# EAGLE schematic TDBR_MCP9802 (EAGLE 7.2.0)
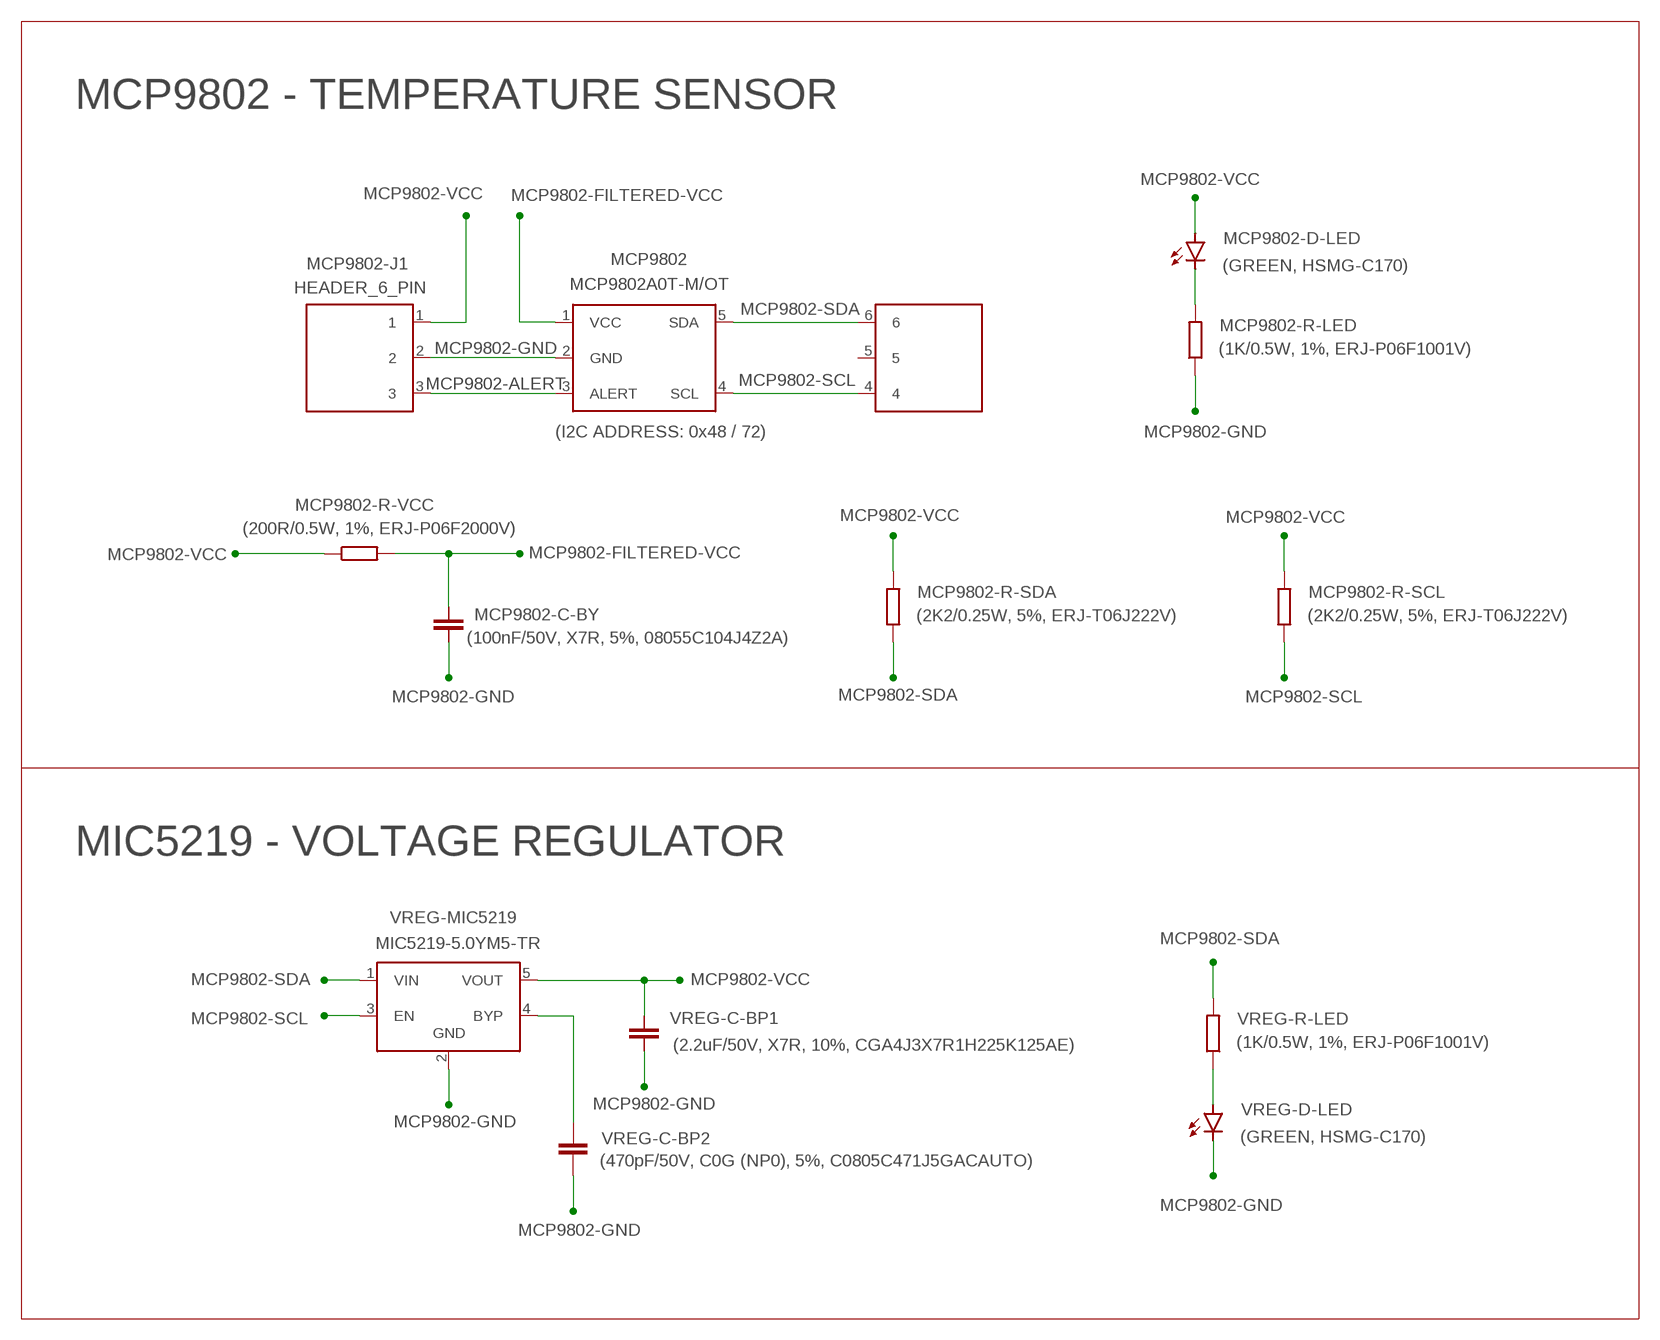
[diagram p0: schematic, sheet 1]

## Parts
MCP9802  MCP9802A0T-M/OT  [SOT-23-5]
MCP9802-C-BY  (100nF/50V, X7R, 5%, 08055C104J4Z2A)  08055C104J4Z2A  [0805]
MCP9802-D-LED  (GREEN, HSMG-C170)  HSMG-C170  [DIODE_0805]
MCP9802-J1  HEADER_6_PIN  [HEADER_2.54MM_6_PIN_VER]
MCP9802-R-LED  (1K/0.5W, 1%, ERJ-P06F1001V)  ERJ-P06F1001V  [0805]
MCP9802-R-SCL  (2K2/0.25W, 5%, ERJ-T06J222V)  ERJ-T06J222V  [0805]
MCP9802-R-SDA  (2K2/0.25W, 5%, ERJ-T06J222V)  ERJ-T06J222V  [0805]
MCP9802-R-VCC  (200R/0.5W, 1%, ERJ-P06F2000V)  ERJ-P06F2000V  [0805]
VREG-C-BP1  (2.2uF/50V, X7R, 10%, CGA4J3X7R1H225K125AE)  CGA4J3X7R1H225K125AE  [0805]
VREG-C-BP2  (470pF/50V, C0G (NP0), 5%, C0805C471J5GACAUTO)  C0805X471J5GACTU  [0805]
VREG-D-LED  (GREEN, HSMG-C170)  HSMG-C170  [DIODE_0805]
VREG-MIC5219  MIC5219-5.0YM5-TR  [SOT-23-5]
VREG-R-LED  (1K/0.5W, 1%, ERJ-P06F1001V)  ERJ-P06F1001V  [0805]

## Nets
MCP9802-ALERT: MCP9802-J1.3 MCP9802.3(ALERT)
MCP9802-FILTERED-VCC: MCP9802-C-BY.1(A) MCP9802-R-VCC.2 MCP9802.1(VCC)
MCP9802-GND: MCP9802-C-BY.2(C) MCP9802-J1.2 MCP9802-R-LED.1 MCP9802.2(GND) VREG-C-BP1.1(A) VREG-C-BP2.1 VREG-D-LED.C VREG-MIC5219.2(GND)
MCP9802-LED: MCP9802-D-LED.C MCP9802-R-LED.2
MCP9802-SCL: MCP9802-J1.4 MCP9802-R-SCL.1 MCP9802.4(SCL) VREG-MIC5219.3(EN)
MCP9802-SDA: MCP9802-J1.6 MCP9802-R-SDA.1 MCP9802.5(SDA) VREG-MIC5219.1(VIN) VREG-R-LED.2
MCP9802-VCC: MCP9802-D-LED.A MCP9802-J1.1 MCP9802-R-SCL.2 MCP9802-R-SDA.2 MCP9802-R-VCC.1 VREG-C-BP1.2(C) VREG-MIC5219.5(VOUT)
MCP9802-VREG-BYP: VREG-C-BP2.2 VREG-MIC5219.4(BYP)
MCP9802-VREG-LED: VREG-D-LED.A VREG-R-LED.1
Unconnected: MCP9802-J1.5

## Notes on the sheet
- MCP9802 - TEMPERATURE SENSOR
- (I2C ADDRESS: 0x48 / 72)
- MIC5219 - VOLTAGE REGULATOR

## Library data of the parts
MCP9802 = TDAR4:MCP9802: MICROCHIP SMD IC TEMPERATURE SENSOR, PROGRAMMABLE, 9-12 BIT, +/-3°C, I2C, AEC-Q100, Automotive http://ww1.microchip.com/downloads/en/DeviceDoc/21909b.pdf I2C ADDRESSES: Part No. Package I2C Address Marking BIN HEX DEC MCP9802A0T-M/OT JKNN 01001000 0x48 72 MCP9802A5T-M/OT JRNN 01001101 0x4D 77 MOUSER: 579-MCP9802A0T-M/OT (MCP9802A0T-M/OT) - 0x48 / 72 579-MCP9802A5T-M/OT (MCP9802A5T-M/OT) - 0x4D / 77 FARNELL: 1439487 (MCP9802A0T-M/OT) - 0X48 / 72 Arduino Library: https://github.com/JChristensen/MCP980X
MCP9802-C-BY = TDAR4:08055C104J4Z2A: AVX SMD MLCC 0.1uF/50V, X7R, 5%, Flexible, Automotive
MCP9802-D-LED VREG-D-LED = TDAR4:HSMG-C170: BROADCOM SMD DIODE LED (GREEN), 15mcd, 20mA, 2.2Vf, 170°, Diffused, Standard
MCP9802-J1 = TDAR4:HEADER_6_PIN
MCP9802-R-LED VREG-R-LED = TDAR4:ERJ-P06F1001V: PANASONIC SMD RESISTOR THICK FILM 1K/0.5W, 1%, 100ppm, AEC-Q200, Automotive
MCP9802-R-SCL MCP9802-R-SDA = TDAR4:ERJ-T06J222V: PANASONIC SMD RESISTOR THICK FILM 2K2/0.25W, 5%, 200ppm, AEC-Q200, Automotive
MCP9802-R-VCC = TDAR4:ERJ-P06F2000V: PANASONIC SMD RESISTOR THICK FILM 200R/0.5W, 1%, 100ppm, AEC-Q200, Automotive
VREG-C-BP1 = TDAR4:CGA4J3X7R1H225K125AE: TDK SMD MLCC 2.2uF/50V, X7R, 10%, Flexible, Class 2, Automotive
VREG-C-BP2 = TDAR4:C0805X471J5GACTU: KEMET SMD CAPACITOR MLCC 470pF/50V, C0G (NP0), 5%, Flexible, AEC–Q200, Automotive MOUSER: C0805C471J5GACAUTO (80-C0805C471J5GAUTO) FARNELL: C0805C471J5GACAUTO (2070481)
VREG-MIC5219 = TDAR4:MIC5219: MICROCHIP SMD VOLTAGE REGULATOR (LOD) 5V, Iout(max): 200/500mA, FIXED, 1%, Vin(max): 12V http://ww1.microchip.com/downloads/en/DeviceDoc/mic5219.pdf MOUSER: SOT-23-5: 998-MIC5219-5.0YM5TR (MIC5219-5.0YM5-TR) MSOP-8: 998-MIC5219-5.0YMM (MIC5219-5.0YMM)

## Net classes
0 default: clearance 0.355 mm